# Altium schematic sheet placa_asier_v1.SchDoc: Adaptador Nutaq
size A4; Author: RCP; DrawnBy: RCP; Engineer: RCP
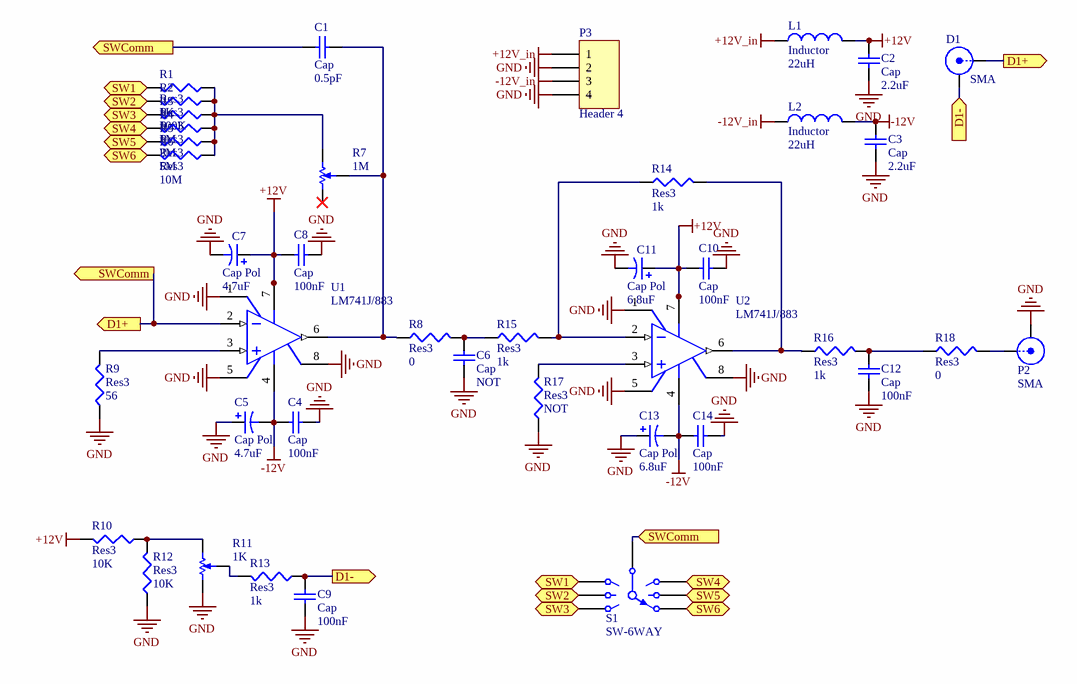
[diagram p0: placa_asier_v1.SchDoc]

## Parts
C1  Cap  value 0.5pF  [1608[0603]]
C2  Cap  value 2.2uF  [6-0805_N]
C3  Cap  value 2.2uF  [6-0805_N]
C4  Cap  value 100nF  [1608[0603]]
C5  Cap Pol  value 4.7uF  [1608[0603]]
C6  Cap  value NOT  [1608[0603]]
C7  Cap Pol  value 4.7uF  [1608[0603]]
C8  Cap  value 100nF  [1608[0603]]
C9  Cap  value 100nF  [1608[0603]]
C10  Cap  value 100nF  [1608[0603]]
C11  Cap Pol  value 6.8uF  [1608[0603]]
C12  Cap  value 100nF  [1608[0603]]
C13  Cap Pol  value 6.8uF  [1608[0603]]
C14  Cap  value 100nF  [1608[0603]]
D1  SMA  [SMB_V-RJ45]
L1  Inductor  value 22uH  [C1210]
L2  Inductor  value 22uH  [C1210]
P2  SMA  [SMB_V-RJ45]
P3  Header 4  [HDR1X4]
R1  Res3  value 1K  [J1-0603]
R2  Res3  value 100K  [J1-0603]
R3  Res3  value 1M  [J1-0603]
R4  Res3  value 2M  [J1-0603]
R5  Res3  value 5M  [J1-0603]
R6  Res3  value 10M  [J1-0603]
R7  1M  [POT4MM-2]
R8  Res3  value 0  [J1-0603]
R9  Res3  value 56  [J1-0603]
R10  Res3  value 10K  [J1-0603]
R11  1K  [POT4MM-2]
R12  Res3  value 10K  [J1-0603]
R13  Res3  value 1k  [J1-0603]
R14  Res3  value 1k  [J1-0603]
R15  Res3  value 1k  [J1-0603]
R16  Res3  value 1k  [J1-0603]
R17  Res3  value NOT  [J1-0603]
R18  Res3  value 0  [J1-0603]
S1  SW-6WAY  [SW-7]
U1  LM741J/883  [J08A]
U2  LM741J/883  [J08A]

## Ports
D1+ (out), D1- (in), D1- (out), SW1 (in), SW1 (out), SW2 (in), SW2 (out), SW3 (in), SW3 (out), SW4 (in), SW4 (out), SW5 (in), SW5 (out), SW6 (in), SW6 (out), SWComm (in), SWComm (out)

## Nets
+12V: C2.1 C7.1 C8.1 C10.1 C11.1 L1.2 R10.2 U1.7(V+) U2.7(V+)
+12V_in: L1.1 P3.1
-12V: C3.2 C4.1 C5.2 C13.2 C14.1 L2.2 U1.4(V-) U2.4(V-)
-12V_in: L2.1 P3.3
GND: C2.2 C3.1 C4.2 C5.1 C6.2 C7.2 C8.2 C9.1 C10.2 C11.2 C12.2 C13.1 C14.2 P2.2(Y) P3.2 P3.4 R9.1 R11.CCW(-) R12.1 R17.1 U1.1(OFS_NULL) U1.5(OFS_NULL) U1.8(NC) U2.1(OFS_NULL) U2.5(OFS_NULL) U2.8(NC)
D1+: C1.2 D1.1(X) S1.7 U1.2(IN-) ; port D1+, port SWComm
D1-: C9.2 D1.2(Y) R13.1 ; port D1-
SW1: R1.2 S1.1 ; port SW1
SW2: R2.2 S1.2 ; port SW2
SW3: R3.2 S1.3 ; port SW3
SW4: R4.2 S1.4 ; port SW4
SW5: R5.2 S1.5 ; port SW5
SW6: R6.2 S1.6 ; port SW6
NetC1_1: C1.1 R7.W R8.1 U1.6(OUT)
NetC6_1: C6.1 R8.2 R15.1
NetC12_1: C12.1 R16.2 R18.1
NetP2_1: P2.1(X) R18.2
NetR1_1: R1.1 R2.1 R3.1 R4.1 R5.1 R6.1 R7.CW(+)
NetR9_2: R9.2 U1.3(IN+)
NetR10_1: R10.1 R11.CW(+) R12.2
NetR11_W: R11.W R13.2
NetR14_1: R14.1 R15.2 U2.2(IN-)
NetR14_2: R14.2 R16.1 U2.6(OUT)
NetR17_2: R17.2 U2.3(IN+)

Not connected (* = marked no-connect by the designer): R7 CCW(-)*

## Library data of the parts
C1 C4 C6 C8-C10 C12 C14 = Cap Semi: Capacitor (Semiconductor SIM Model); Published: 8-Jun-2000; LatestRevisionDate: 29-May-2009; LatestRevisionNote: IPC-7351 Footprint Added.; PackageReference: C1206; Publisher: Altium Limited; PackageDescription: Chip Capacitor
C2 C3 = Cap: Capacitor; Published: 8-Jun-2000; LatestRevisionDate: 17-Jul-2002; LatestRevisionNote: Re-released for DXP Platform.; PackageReference: RAD-0.3; Publisher: Altium Limited; PackageDescription: Radial Cap, Thru-Hole; 2 Leads; 0.3 in Pin Spacing
C5 C7 C11 C13 = Cap Pol3: Polarized Capacitor (Surface Mount); Published: 8-Jun-2000; LatestRevisionDate: 29-May-2009; LatestRevisionNote: IPC-7351 Footprint Added.; PackageReference: C0805; Publisher: Altium Limited; PackageDescription: Chip Capacitor
D1 P2 = SMB: SMB Straight Connector; LatestRevisionDate: 17-Jul-2002; LatestRevisionNote: Re-released for DXP Platform.; Publisher: Altium Limited
L1 L2 = Inductor: Code_IEC: 1005; Published: 8-Jun-2000; LatestRevisionDate: 29-May-2009; LatestRevisionNote: IPC-7351 Footprint Added.; PackageReference: 0402-A; Publisher: Altium Limited; PackageDescription: Chip Inductor; Code_JEITA: 0402
P3 = Header 4: Header, 4-Pin; LatestRevisionDate: 17-Jul-2002; LatestRevisionNote: Re-released for DXP Platform.; Publisher: Altium Limited
R1-R6 R8-R10 R12-R18 = Res3: Resistor; Published: 8-Jun-2000; LatestRevisionDate: 29-May-2009; LatestRevisionNote: IPC-7351 Footprint Added.; PackageReference: J1-0603; Publisher: Altium Limited; PackageDescription: Chip Resistor
R7 R11 = RPot SM: Square Trimming Potentiometer; Published: 17-Dec-2003; DatasheetVersion: Oct-2003; PackageReference: POT4MM-2; Publisher: Altium Limited; PackageDescription: Square Trimming Potentiometer; ComponentLink1Description: Manufacturer Link; ComponentLink1URL: http://bourns.com/2/search.html
S1 = SW-6WAY: 6 Way Switch; Published: 24-Mar-1999; LatestRevisionDate: 17-Jul-2002; LatestRevisionNote: Re-released for DXP Platform.; PackageReference: SW-7; Publisher: Altium Limited; PackageDescription: Switch; 7 Leads
U1 U2 = CMP-0055-00144-1: Operational Amplifier, 8-pin CerDIP; Manufacturer: National Semiconductor; PowerWise: N; PackageTopMarking: NSZSSXXYYA*LM741J/*883 Q; CompType: Amplifiers; High-Reliability: Y; PinCount: 8; PackageReference: J08A; PackageDescription: Cerdip, .400 x .310in Body, 8 Lead, .300in Centers, .100in Pitch; DatasheetVersion: Aug-2000; PackageVersion: revM, Jul-2002; RoHS: N